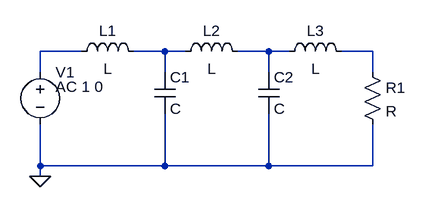
[diagram p0: schematic Draft2.asc]
Draft2.asc, the LTspice schematic file:
Version 4
SHEET 1 880 680
WIRE 48 192 -16 192
WIRE 176 192 128 192
WIRE 208 192 176 192
WIRE 336 192 288 192
WIRE 368 192 336 192
WIRE 496 192 448 192
WIRE -16 224 -16 192
WIRE 176 224 176 192
WIRE 336 224 336 192
WIRE 496 224 496 192
WIRE -16 368 -16 304
WIRE 176 368 176 288
WIRE 176 368 -16 368
WIRE 336 368 336 288
WIRE 336 368 176 368
WIRE 496 368 496 304
WIRE 496 368 336 368
WIRE -16 384 -16 368
FLAG -16 384 0
SYMBOL ind 32 208 R270
WINDOW 0 32 56 VTop 2
WINDOW 3 5 56 VBottom 2
SYMATTR InstName L1
SYMBOL ind 192 208 R270
WINDOW 0 32 56 VTop 2
WINDOW 3 5 56 VBottom 2
SYMATTR InstName L2
SYMBOL ind 352 208 R270
WINDOW 0 32 56 VTop 2
WINDOW 3 5 56 VBottom 2
SYMATTR InstName L3
SYMBOL cap 160 224 R0
SYMATTR InstName C1
SYMBOL cap 320 224 R0
SYMATTR InstName C2
SYMBOL res 480 208 R0
SYMATTR InstName R1
SYMBOL voltage -16 208 R0
WINDOW 123 24 38 Left 2
SYMATTR InstName V1
SYMATTR Value ""
SYMATTR Value2 AC 1 0

The netlist it stands for:
* Draft2.asc
L1 N001 N002 L
L2 N002 N003 L
L3 N003 N004 L
C1 N002 0 C
C2 N003 0 C
R1 N004 0 R
V1 N001 0 AC 1 0
.backanno
.end